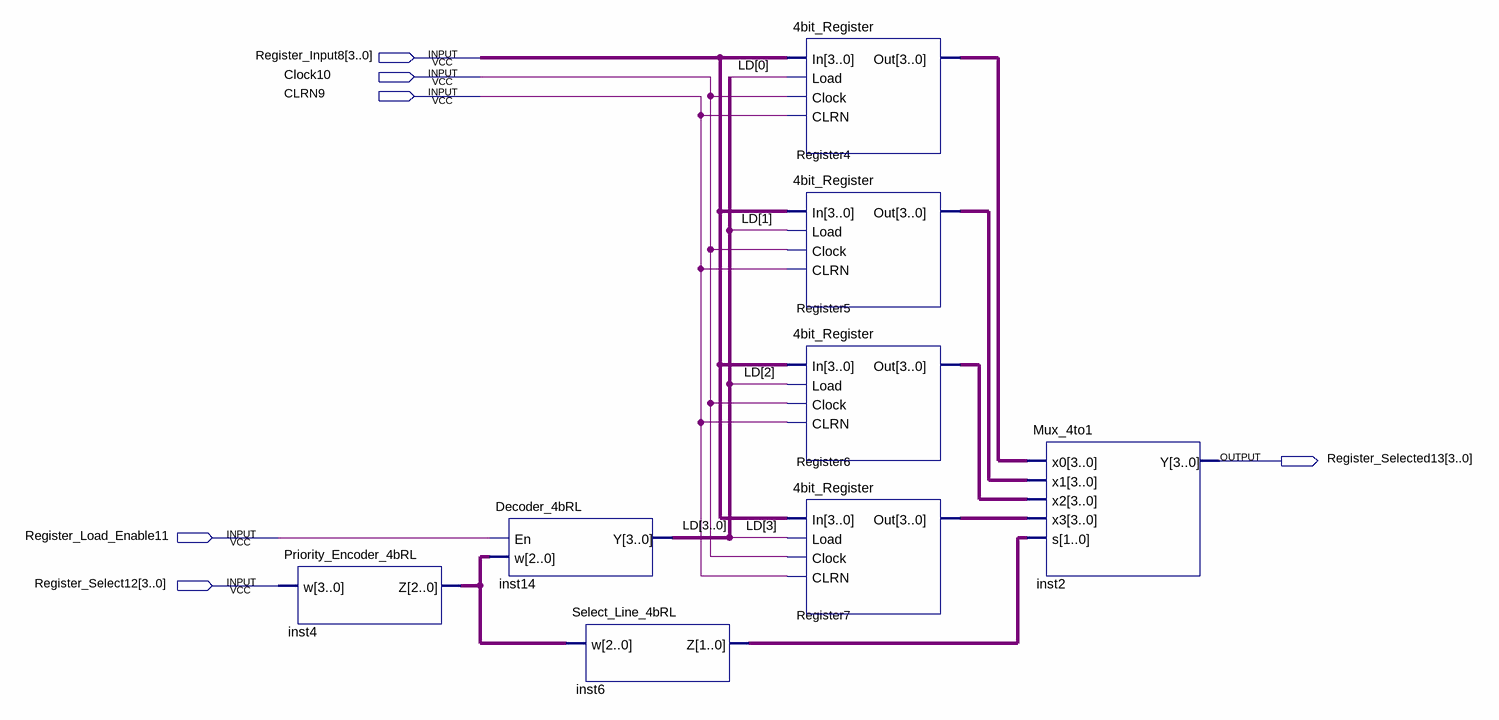
[diagram p0: schematic sheet]
// Quartus schematic 4_4bit_Register_File.bdf as structural Verilog: 8 symbols, 6 pins
module \4_4bit_Register_File  (
  input  [3:0] Register_Input8,
  input  Clock10,
  input  CLRN9,
  input  Register_Load_Enable11,
  input  [3:0] Register_Select12,
  output [3:0] Register_Selected13
);

  wire [1:0] inst6_z;
  wire [2:0] inst4_z;
  wire [3:0] LD, Register4_out, Register5_out, Register6_out, Register7_out;

  Priority_Encoder_4bRL inst4 (.w(Register_Select12), .Z(inst4_z));
  Decoder_4bRL inst14 (.En(Register_Load_Enable11), .w(inst4_z), .Y(LD));
  Select_Line_4bRL inst6 (.w(inst4_z), .Z(inst6_z));
  \4bit_Register  Register4 (.In(Register_Input8), .Load(LD[0]), .Clock(Clock10), .CLRN(CLRN9), .Out(Register4_out));
  \4bit_Register  Register5 (.In(Register_Input8), .Load(LD[1]), .Clock(Clock10), .CLRN(CLRN9), .Out(Register5_out));
  \4bit_Register  Register6 (.In(Register_Input8), .Load(LD[2]), .Clock(Clock10), .CLRN(CLRN9), .Out(Register6_out));
  \4bit_Register  Register7 (.In(Register_Input8), .Load(LD[3]), .Clock(Clock10), .CLRN(CLRN9), .Out(Register7_out));
  Mux_4to1 inst2 (
    .x0(Register4_out), .x1(Register5_out), .x2(Register6_out), .x3(Register7_out), .s(inst6_z),
    .Y(Register_Selected13));
endmodule
